# Altium schematic sheet Licznik_minut.SchDoc
size A4; SheetNumber: 3; SheetTotal: 8
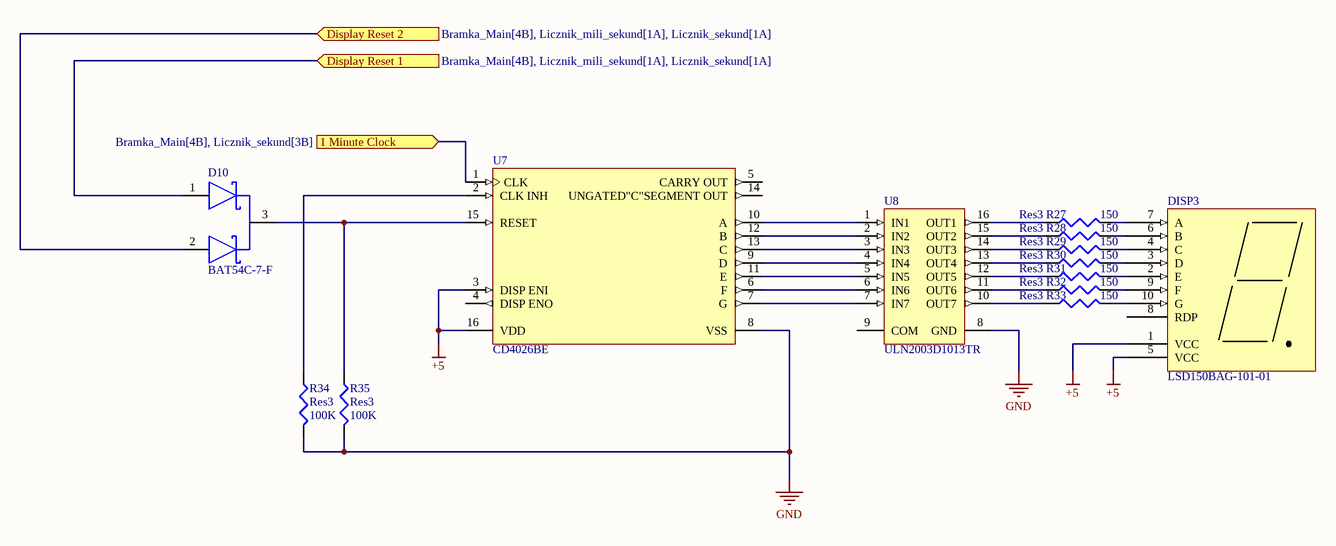
[diagram p0: Licznik_minut.SchDoc]

## Parts
D10  BAT54C-7-F  [FP-SOT23-IPC_B]
DISP3  LSD150BAG-101-01  [7 segment display]
R27  Res3  value 150  [6-0805_M]
R28  Res3  value 150  [6-0805_M]
R29  Res3  value 150  [6-0805_M]
R30  Res3  value 150  [6-0805_M]
R31  Res3  value 150  [6-0805_M]
R32  Res3  value 150  [6-0805_M]
R33  Res3  value 150  [6-0805_M]
R34  Res3  value 100K  [J1-0603]
R35  Res3  value 100K  [J1-0603]
U7  CD4026BE  [N0016A]
U8  ULN2003D1013TR  [STM-SO-16_M]

## Ports
1 Minute Clock (in, see Bramka_Main[4B], Licznik_sekund[3B]), Display Reset 1 (in, see Bramka_Main[4B], Licznik_mili_sekund[1A], Licznik_sekund[1A]), Display Reset 2 (in, see Bramka_Main[4B], Licznik_mili_sekund[1A], Licznik_sekund[1A])

## Nets
+5: DISP3.1(VCC) DISP3.5(VCC) U7.3(DISP_ENI) U7.16(VDD)
GND: R34.2 R35.2 U7.8(VSS) U8.8(GND)
1 Minute Clock: U7.1(CLK) ; port 1 Minute Clock
Display Reset 1: D10.1(1_ANODE) ; port Display Reset 1
Display Reset 2: D10.2(2_ANODE) ; port Display Reset 2
NetD10_3: D10.3(COMMON_CATHODE) R35.1 U7.15(RESET)
NetDISP3_2: DISP3.2(E) R31.2
NetDISP3_3: DISP3.3(D) R30.2
NetDISP3_4: DISP3.4(C) R29.2
NetDISP3_6: DISP3.6(B) R28.2
NetDISP3_7: DISP3.7(A) R27.2
NetDISP3_9: DISP3.9(F) R32.2
NetDISP3_10: DISP3.10(G) R33.2
NetR27_1: R27.1 U8.16(OUT1)
NetR28_1: R28.1 U8.15(OUT2)
NetR29_1: R29.1 U8.14(OUT3)
NetR30_1: R30.1 U8.13(OUT4)
NetR31_1: R31.1 U8.12(OUT5)
NetR32_1: R32.1 U8.11(OUT6)
NetR33_1: R33.1 U8.10(OUT7)
NetR34_1: R34.1 U7.2(CLK_INH)
NetU7_6: U7.6(F) U8.6(IN6)
NetU7_7: U7.7(G) U8.7(IN7)
NetU7_9: U7.9(D) U8.4(IN4)
NetU7_10: U7.10(A) U8.1(IN1)
NetU7_11: U7.11(E) U8.5(IN5)
NetU7_12: U7.12(B) U8.2(IN2)
NetU7_13: U7.13(C) U8.3(IN3)

Not connected (* = marked no-connect by the designer): DISP3 8(RDP); U7 4(DISP_ENO) 5(CARRY_OUT) 14(UNGATED"C"SEGMENT_OUT); U8 9(COM)

## Library data of the parts
D10 = CMP-12790-000084-1: DIODE ARRAY SCHOTTKY 30V SOT23-3; Max Reverse Current: 2uA; Power Dissipation: 200mW; Average Rectified Current: 200mA; Capacitance: 10pF; Peak Non-Repetitive Surge Current: 600mA; Forward Voltage: 800mV; Reverse Recovery Time: 5ns; Element Configuration: Common Cathode; Max Operating Temperature: 150°C; Max Reverse Voltage (DC): 30V; Power Rating: 200mW; Termination: SMD/SMT; REACH SVHC: No SVHC; Voltage Rating (DC): 30V; Series: -; Current Rating: 200mA; RoHS Compliant: Yes; Max Power Dissipation: 200mW; Case/Package: SOT-23; Max Repetitive Reverse Voltage (Vrrm): 30V; Width: 1.3mm; Min Operating Temperature: -65°C; Lead Free: Lead Free; Forward Current: 200mA; Number of Pins: 3; Contact Plating: Tin; Package Quantity: 3000; Length: 2.9mm; Radiation Hardening: No; Max Forward Surge Current (Ifsm): 600mA; Height: 1mm; Packaging: Tape and Reel; Mount: Surface Mount; Weight: 0.000282oz
DISP3 = CMP-007-00036-2: 7 segment display 1.5 inch
R27-R35 = Res3: Resistor; Published: 8-Jun-2000; LatestRevisionDate: 29-May-2009; LatestRevisionNote: IPC-7351 Footprint Added.; PackageReference: J1-0603; Publisher: Altium Limited; PackageDescription: Chip Resistor
U7 = CMP-1623-00561-2: CMOS Decade Counter/Divider with Decoded 7-Segment Display Outputs and Display Enable, N0016A, TUBE; Manufacturer: Texas Instruments; ICC @ Nom Voltage(Max)(mA): 0.03; tpd @ Nom Voltage(Max)(ns): 250; F @ Nom Voltage(Max)(Mhz): 8; Bits(#): 7; VCC(Max)(V): 18; VCC(Min)(V): 3; Output Drive (IOL/IOH)(Max)(mA): 1.5/-1.5; Inputs: 1; Rating: Catalog; Technology Family: CD4000; Schmitt Trigger: No; Voltage(Nom)(V): 5,10,15; DatasheetVersion: SCHS031B; Operating Temperature Range(C): -55 to 125; Code_JEDEC: MS-001; Input Type: CMOS; Output Type: CMOS; Type: Decade; Generic Part Number: CD4026B; PackageReference: N0016A; Function: Counter
U8 = CMP-2000-05374-1: Seven NPN Darlington Array Transistor, 50 V, 500 mA, -40 to 85 degC, 8-Pin SOIC, RoHS, Tape and Reel; Manufacturer: STMicroelectronics; Collector Emitter Voltage V(br)ceo: 50V; SVHC: NoSVHC(17-Dec-2015); DC Current Gain hFE: 1000hFE; DC Collector Current: 500mA; No. of Pins: 16Pins; Package Reference: SO-16; Transistor Polarity: NPN; Transistor Case Style: SOIC; Datasheet URL: https://datasheet.ciiva.com/1193/1690348-1193460.pdf; Package Description: 16-Pin Small Outline Integrated Circuit, Body 9.9 x 3.9 mm, Pitch 1.27 mm; Datasheet Version: Rev. 8, 06/2012; Power Dissipation Pd: -; Product Range: -; Operating Temperature Max: 85degC; MSL: MSL1-Unlimited; Manufacturer URL: http://www.st.com/; Automotive Qualification Standard: -